# Altium schematic sheet Sheet1.SchDoc
size A4; SheetNumber: 1; SheetTotal: 2
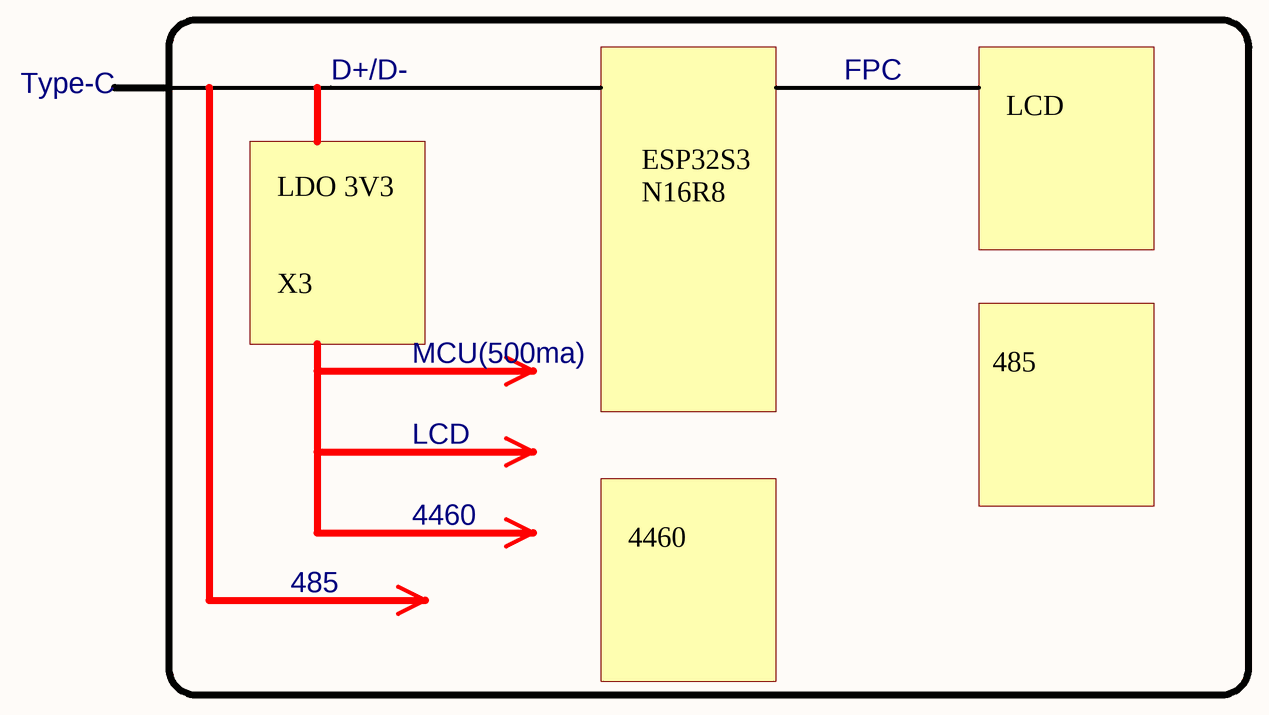
[diagram p0: Sheet1.SchDoc]

## Notes on the sheet
- Type-C
- D+/D-
- FPC
- ESP32S3
  N16R8
- LCD
- LDO 3V3
  X3
- MCU(500ma)
- 485
- 4460